# EAGLE design controller (EAGLE 6.4)
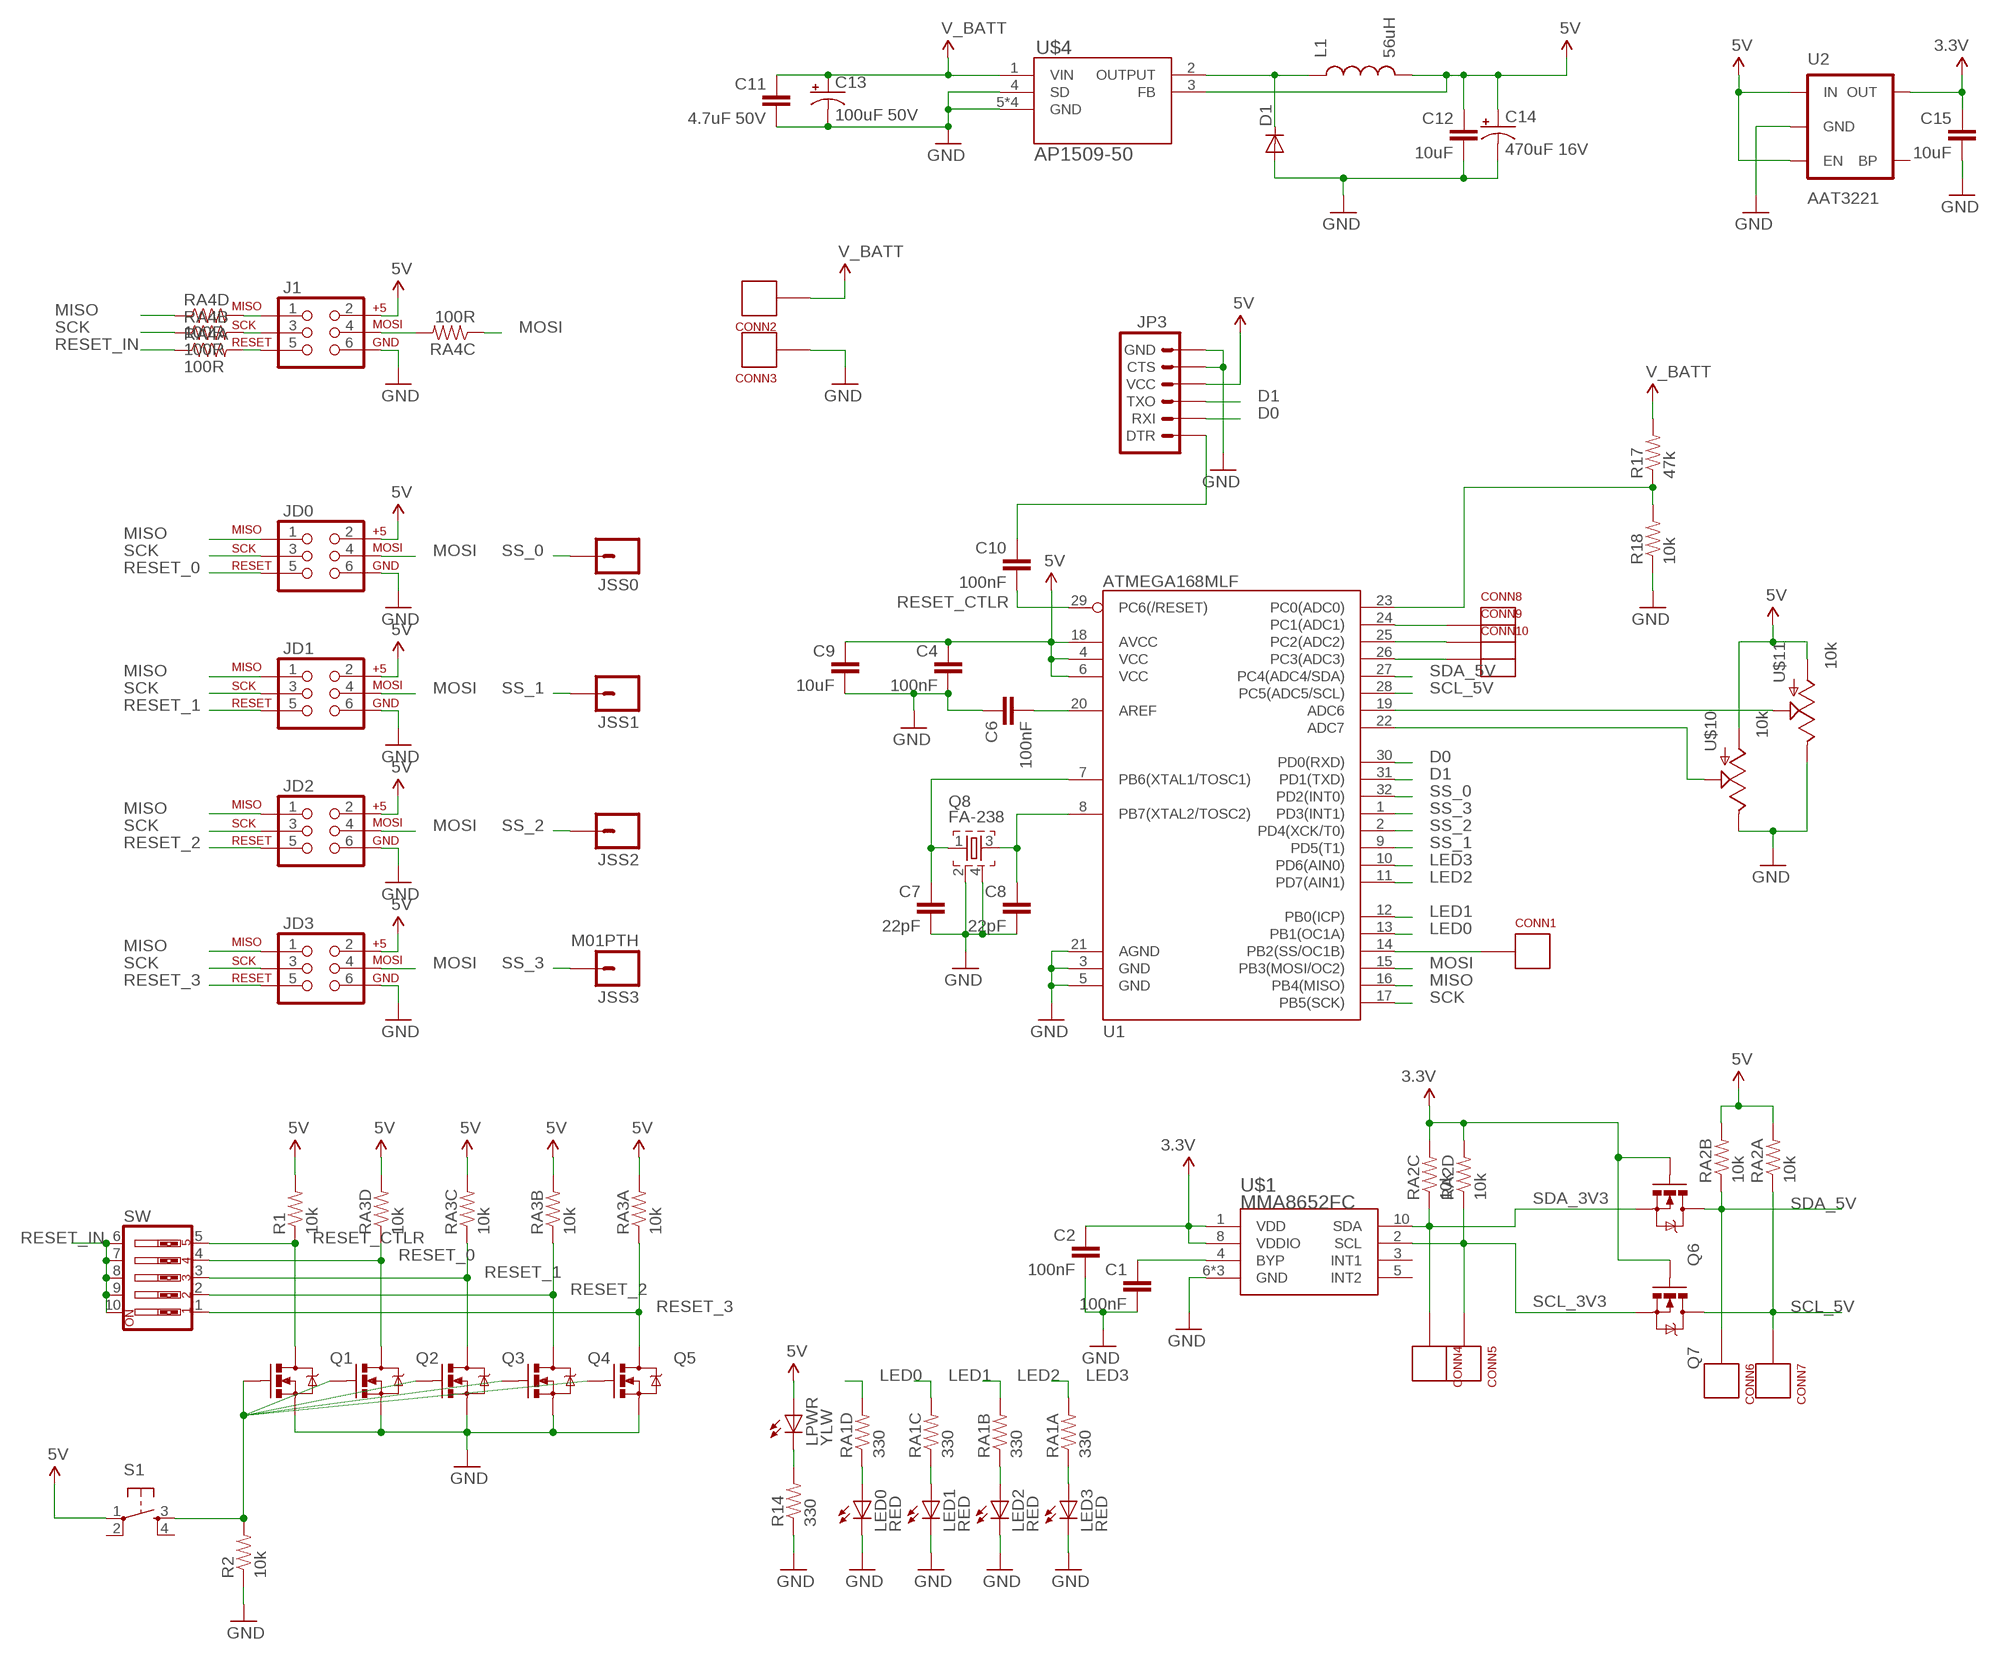
[diagram p0: schematic, sheet 1]

## Parts
C1  100nF  CAP0402-CAP  [0402-CAP]
C2  100nF  CAP0402-CAP  [0402-CAP]
C4  100nF  CAP0402-CAP  [0402-CAP]
C6  100nF  CAP0402-CAP  [0402-CAP]
C7  22pF  CAP0402-CAP  [0402-CAP]
C8  22pF  CAP0402-CAP  [0402-CAP]
C9  10uF  CAP0805  [0805]
C10  100nF  CAP0402-CAP  [0402-CAP]
C11  4.7uF 50V  CAP0805  [0805]
C12  10uF  CAP0805  [0805]
C13  100uF 50V  CAP_POLPTH6  [CAP-8-3.5]
C14  470uF 16V  CAP_POLPTH6  [CAP-8-3.5]
C15  10uF  CAP0805  [0805]
CONN1  SS  CONNECTOR  [TESTPAD]
CONN2  CONNECTOR18AWG  [HOLE_18AWG]
CONN3  CONNECTOR18AWG  [HOLE_18AWG]
CONN4  D33  CONNECTOR  [TESTPAD]
CONN5  C33  CONNECTOR  [TESTPAD]
CONN6  D50  CONNECTOR  [TESTPAD]
CONN7  C50  CONNECTOR  [TESTPAD]
CONN8  PC1  CONNECTOR  [TESTPAD]
CONN9  PC2  CONNECTOR  [TESTPAD]
CONN10  PC3  CONNECTOR  [TESTPAD]
D1  DIODESOD123W  [SOD123W(NXP)]
J1  AVR_SPI_PRG_6PTH  [2X3]
JD0  AVR_SPI_PRG_6PTH  [2X3]
JD1  AVR_SPI_PRG_6PTH  [2X3]
JD2  AVR_SPI_PRG_6PTH  [2X3]
JD3  AVR_SPI_PRG_6PTH  [2X3]
JP3  ARDUINO_SERIAL_PROGRAMPTH  [1X06]
JSS0  M01PTH  [1X01]
JSS1  M01PTH  [1X01]
JSS2  M01PTH  [1X01]
JSS3  M01PTH  [1X01]
L1  56uH  INDUCTOR1210  [1210]
LED0  RED  LED-RED0603  [LED-0603]
LED1  RED  LED-RED0603  [LED-0603]
LED2  RED  LED-RED0603  [LED-0603]
LED3  RED  LED-RED0603  [LED-0603]
LPWR  YLW  LED-RED0603  [LED-0603]
Q1  MOSFET-NCHANNELBSS123LT1G  [SOT23]
Q2  MOSFET-NCHANNELBSS123LT1G  [SOT23]
Q3  MOSFET-NCHANNELBSS123LT1G  [SOT23]
Q4  MOSFET-NCHANNELBSS123LT1G  [SOT23]
Q5  MOSFET-NCHANNELBSS123LT1G  [SOT23]
Q6  MOSFET-NCHANNELBSS123LT1G  [SOT23]
Q7  MOSFET-NCHANNELBSS123LT1G  [SOT23]
Q8  FA-238  [FA-238]
R1  10k  RESISTOR0603  [0603-RES]
R2  10k  RESISTOR0603  [0603-RES]
R14  330  RESISTOR0603  [0603-RES]
R17  47k  RESISTOR0603  [0603-RES]
R18  10k  RESISTOR0603  [0603-RES]
RA1  330  RESISTOR_ARRAY0603_X4  [0603-ARV]
RA2  10k  RESISTOR_ARRAY0603_X4  [0603-ARV]
RA3  10k  RESISTOR_ARRAY0603_X4  [0603-ARV]
RA4  100R  RESISTOR_ARRAY0603_X4  [0603-ARV]
S1  TAC_SWITCHPTH  [TACTILE-PTH]
SW  SW_DIP-5  [DIPSWITCH-05]
U1  ATMEGA168MLF  [MLF32]
U2  AAT3221  V_REG_LDOSMD  [SOT23-5]
U$1  MMA8652FC  [DFN-10]
U$4  AP1509-50  AP1509  [SO08]
U$10  10k  POTTRIM  [TRIM_POT]
U$11  10k  POTTRIM  [TRIM_POT]

## Nets
3.3V: C2.1 C15.1 Q6.1(G) Q7.1(G) RA2.5 RA2.6 U2.5(OUT) U$1.1(VDD) U$1.8(VDDIO)
5V: C4.1 C9.1 C12.1 C14.1(+) J1.2 JD0.2 JD1.2 JD2.2 JD3.2 JP3.4(VCC) L1.2 LPWR.A R1.2 RA2.7 RA2.8 RA3.5 RA3.6 RA3.7 RA3.8 S1.1 U1.4(VCC) U1.6(VCC) U1.18(AVCC) U2.1(IN) U2.3(EN) U$4.3(FB) U$10.3(A) U$11.3(A)
D0: JP3.2(RXI) U1.30(PD0(RXD))
D1: JP3.3(TXO) U1.31(PD1(TXD))
GND: C1.2 C2.2 C4.2 C6.1 C7.2 C8.2 C9.2 C11.2 C12.2 C13.2(-) C14.2(-) C15.2 CONN3.P$1(P) D1.A J1.6 JD0.6 JD1.6 JD2.6 JD3.6 JP3.5(CTS) JP3.6(GND) LED0.C LED1.C LED2.C LED3.C Q1.2(S) Q2.2(S) Q3.2(S) Q4.2(S) Q5.2(S) Q8.2 Q8.4 R2.1 R14.1 R18.1 U1.3(GND) U1.5(GND) U1.21(AGND) U2.2(GND) U$1.6(GND) U$1.7(GND) U$1.9(GND) U$4.4(SD) U$4.5(GND) U$4.6(GND) U$4.7(GND) U$4.8(GND) U$10.2(E) U$11.2(E)
LED0: RA1.5 U1.13(PB1(OC1A))
LED1: RA1.6 U1.12(PB0(ICP))
LED2: RA1.7 U1.11(PD7(AIN1))
LED3: RA1.8 U1.10(PD6(AIN0))
MISO: JD0.1 JD1.1 JD2.1 JD3.1 RA4.4 U1.16(PB4(MISO))
MOSI: JD0.4 JD1.4 JD2.4 JD3.4 RA4.3 U1.15(PB3(MOSI/OC2))
N$1: Q1.1(G) Q2.1(G) Q3.1(G) Q4.1(G) Q5.1(G) R2.2 S1.3
N$2: C8.1 Q8.3 U1.8(PB7(XTAL2/TOSC2))
N$3: C1.1 U$1.4(BYP)
N$4: C6.2 U1.20(AREF)
N$5: C7.1 Q8.1 U1.7(PB6(XTAL1/TOSC1))
N$6: CONN1.P U1.14(PB2(SS/OC1B))
N$7: LPWR.C R14.2
N$8: J1.5 RA4.8
N$9: J1.4 RA4.6
N$10: J1.1 RA4.5
N$11: LED0.A RA1.4
N$12: R17.1 R18.2 U1.23(PC0(ADC0))
N$13: LED1.A RA1.3
N$14: C10.1 JP3.1(DTR)
N$15: J1.3 RA4.7
N$16: LED2.A RA1.2
N$17: CONN8.P U1.24(PC1(ADC1))
N$18: U1.19(ADC6) U$11.1(S)
N$19: U1.22(ADC7) U$10.1(S)
N$20: CONN9.P U1.25(PC2(ADC2))
N$21: CONN10.P U1.26(PC3(ADC3))
N$22: LED3.A RA1.1
N$24: D1.C L1.1 U$4.2(OUTPUT)
RESET_0: JD0.5 Q2.3(D) RA3.4 SW.4
RESET_1: JD1.5 Q3.3(D) RA3.3 SW.3
RESET_2: JD2.5 Q4.3(D) RA3.2 SW.2
RESET_3: JD3.5 Q5.3(D) RA3.1 SW.1
RESET_CTLR: C10.2 Q1.3(D) R1.1 SW.5 U1.29(PC6(/RESET))
RESET_IN: RA4.1 SW.6 SW.7 SW.8 SW.9 SW.10
SCK: JD0.3 JD1.3 JD2.3 JD3.3 RA4.2 U1.17(PB5(SCK))
SCL_3V3: CONN5.P Q7.2(S) RA2.4 U$1.2(SCL)
SCL_5V: CONN7.P Q7.3(D) RA2.1 U1.28(PC5(ADC5/SCL))
SDA_3V3: CONN4.P Q6.2(S) RA2.3 U$1.10(SDA)
SDA_5V: CONN6.P Q6.3(D) RA2.2 U1.27(PC4(ADC4/SDA))
SS_0: JSS0.1 U1.32(PD2(INT0))
SS_1: JSS1.1 U1.9(PD5(T1))
SS_2: JSS2.1 U1.2(PD4(XCK/T0))
SS_3: JSS3.1 U1.1(PD3(INT1))
V_BATT: C11.1 C13.1(+) CONN2.P$1(P) R17.2 U$4.1(VIN)
Unconnected: S1.2 S1.4 U2.4(BP) U$1.3(INT1) U$1.5(INT2)

## Library data of the parts
C1 C2 C4 C6-C12 C15 = kmod:CAP: Capacitor Standard 0603 ceramic capacitor, and 0.1" leaded capacitor.
C13 C14 = kmod:CAP_POL: Capacitor Polarized These are standard SMD and PTH capacitors. Normally 10uF, 47uF, and 100uF in electrolytic and tantalum varieties. Always verify the external diameter of the through hole cap, it varies with capacity, voltage, and manufacturer. The EIA devices should be standard.
CONN1-CONN10 = kmod:CONNECTOR
D1 = kmod:DIODE
J1 JD0 JD1-JD3 = SparkFun-Connectors:AVR_SPI_PRG_6: AVR ISP 6 Pin This is the reduced ISP connector for AVR programming. Common on Arduino. This footprint will take up less PCB space and can be used with a 10-pin to 6-pin adapter such as SKU: BOB-08508
JP3 = SparkFun-Connectors:ARDUINO_SERIAL_PROGRAM: FTDI connector footprints
JSS0 JSS1-JSS3 = SparkFun-Connectors:M01: Header 1 Standard 1-pin 0.1" header. Use with straight break away headers (SKU : PRT-00116), right angle break away headers (PRT-00553), swiss pins (PRT-00743), machine pins (PRT-00117), and female headers (PRT-00115).
L1 = SparkFun-Passives:INDUCTOR: Inductors Basic Inductor/Choke - 0603 and 1206. Footprints are not proven and vary greatly between part numbers. SRN6045- 33uH, 20% 1.4A
LED0 LED1-LED3 = SparkFun-LED:LED-RED: Assorted Red LEDs LilyPad 1206- DIO-09912 1206- DIO-00809 0603- DIO-00819; PROD_ID: DIO-00819
LPWR = SparkFun-LED:LED-RED: Assorted Red LEDs LilyPad 1206- DIO-09912 1206- DIO-00809 0603- DIO-00819; PROD_ID: DIO-00819; VALUE: RED
Q1-Q7 = SparkFun-DiscreteSemi:MOSFET-NCHANNEL: Common NMOSFET Parts MFG P/N Store ID Prod ID FDD8780 TRANS-09984 SI7820DN TRANS-11055 FDS6630A IC-08089 2N7002PW TRANS-11151 FQP30N06L COM-10213 TRANS-10060 BSS123LT1G TRANS-08345 BSS138 TRANS-00830 BS170 2N7000; PROD_ID: TRANS-08345
Q8 = kmod:FA-: MHz RANGE CRYSTAL UNIT Source: Epson Toyocom
R1 R2 R17 R18 = kmod:RESISTOR: Resistor Basic schematic elements and footprints for 0603, 1206, and PTH resistors.
R14 = SparkFun-Resistors:RESISTOR: Resistor Basic schematic elements and footprints for 0603, 1206, and PTH resistors.
RA1-RA4 = kmod:RESISTOR_ARRAY
S1 = SparkFun-Electromechanical:TAC_SWITCH: Momentary Switch Button commonly used for reset or general input. Spark Fun Electronics SKU : COM-00097 SMT- SWCH-08247
SW = SparkFun-DiscreteSemi:SW_DIP-5
U1 = SparkFun-DigitalIC:ATMEGA168: Atmel 32-pin 8-bit micro, 16k flash.
U2 = SparkFun-PowerIC:V_REG_LDO: Voltage Regulator LDO Standard 150mA LDO voltage regulator in SOT-23 layout. Micrel part MIC5205. BP (by-pass) pin is used to lower output noise with 470pF cap.
U$1 = kmod:MMA8652FC: Freescale MMA8652FC 3-axis accelerometer
U$4 = kmod:AP1509
U$10 U$11 = kmod:POT

## Board
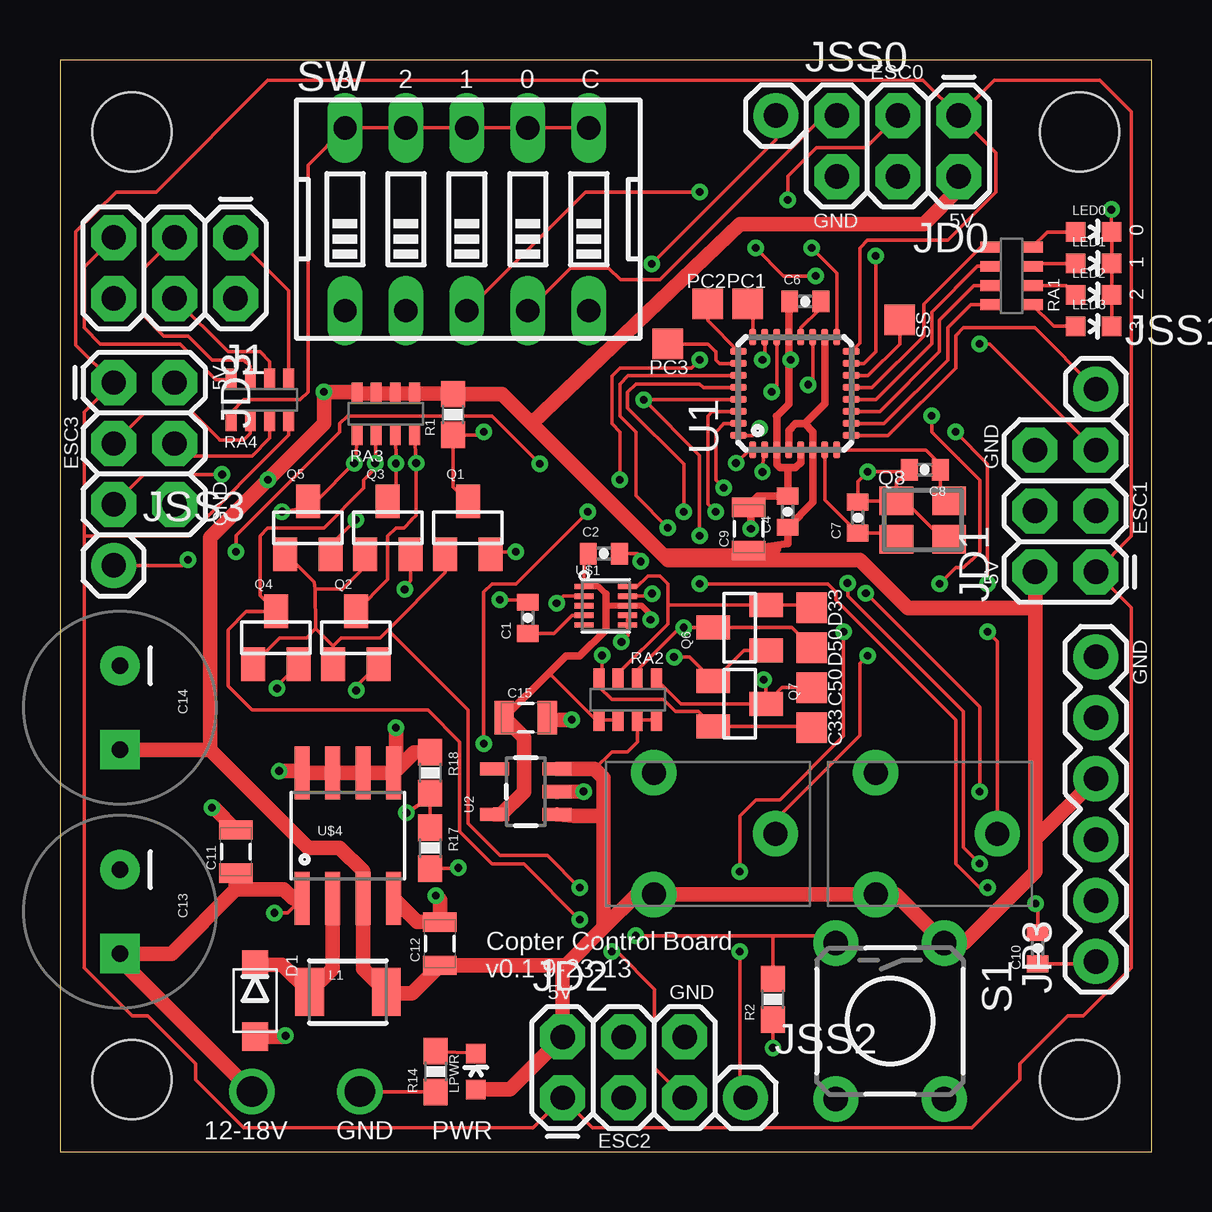
[diagram p1: board, top side]
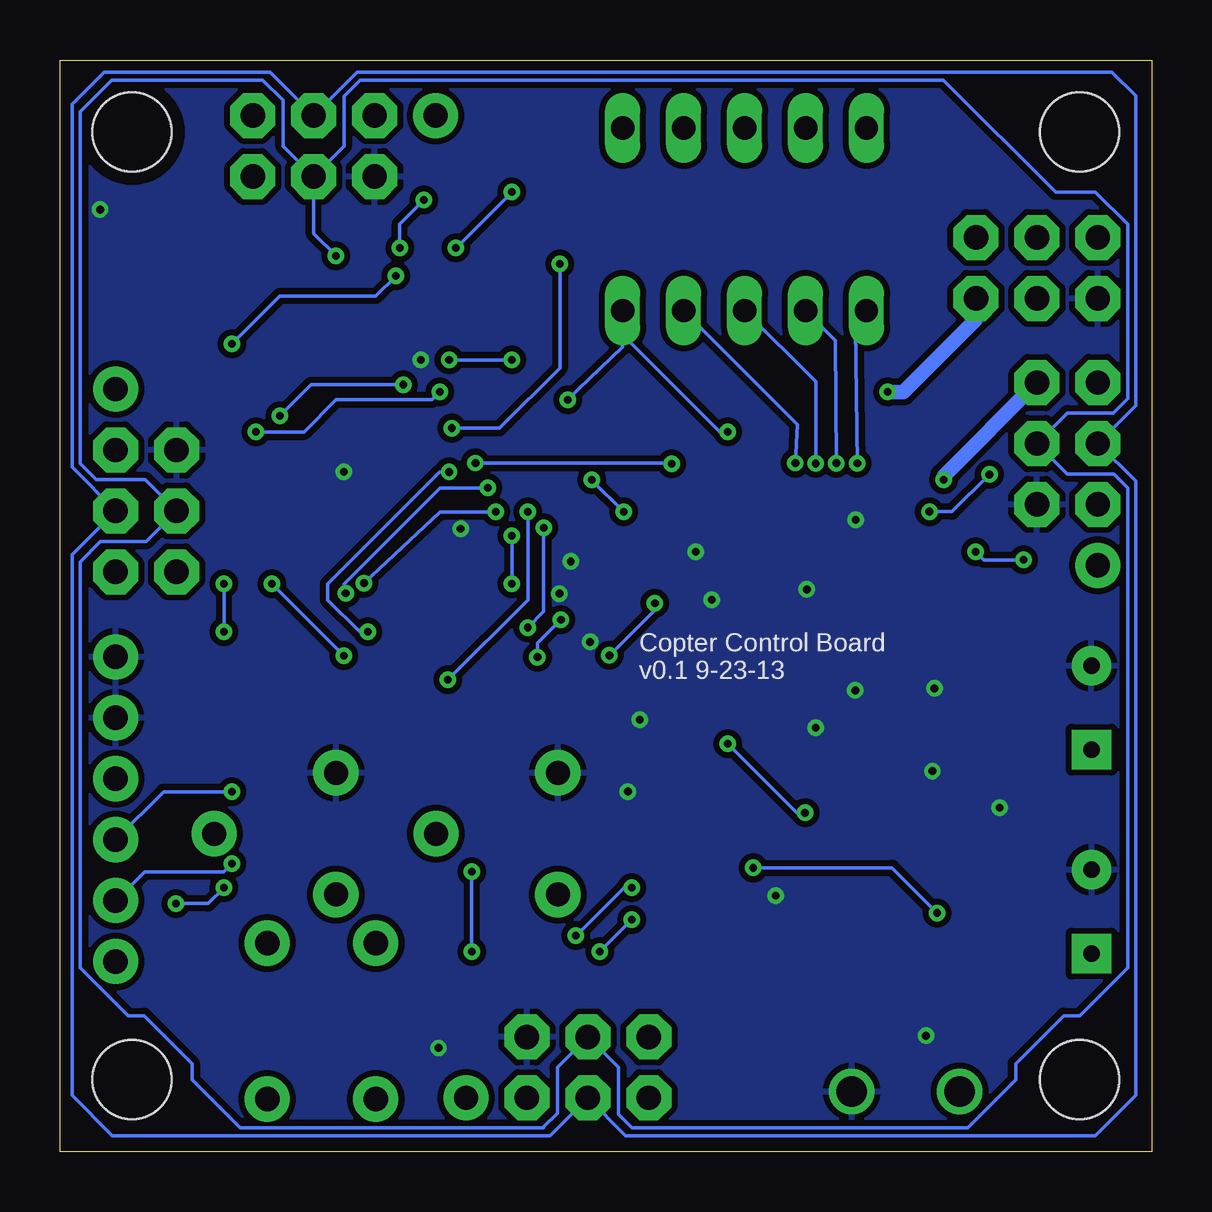
[diagram p2: board, bottom side, seen from below]

Size 45.5 x 45.5 mm. Coordinates in mm from the lower left corner, seen from the top.
Outline: 0,0 45.5,0 45.5,45.5 0,45.5 0,0
Copper layers (1*16): Top 0.0356mm / dielectric 1.5011mm / Bottom 0.0356mm
Design rules "OSHPark_mine": minimum track width 6mil, minimum drill 13mil, track to track 6mil, track to pad 6mil, pad to pad 6mil, via to via 6mil, smd to smd 6mil, copper to edge 15mil, drill to drill 6mil, minimum pad ring 7mil, minimum via ring 7mil, stop-mask expansion 2mil, vias tented up to drill 13mil, thermal gap 10mil

### Footprints (pad centres in the part's own frame; a part is rotated, then mirrored left to right if it is on the bottom)
0402-CAP = smd 0.7 x 0.9: 1 -0.65,0; 2 0.65,0
0805 = smd 0.8 x 1.4: 1 -0.9,0; 2 0.9,0
CAP-8-3.5 = drill 0.7 pad 1.651 square: 1 1.75,0 | drill 0.7 pad 1.651: 2 -1.75,0
TESTPAD = smd 1.27 x 1.27: P 0,0
HOLE_18AWG = drill 1.27: P$1 0,0
SOD123W(NXP) = smd 1.2 x 1.1: A 1.5,0; C -1.5,0
2X3 = drill 1.016 pad 1.88 octagon: 1 0,0; 2 0,2.54; 3 2.54,0; 4 2.54,2.54; 5 5.08,0; 6 5.08,2.54
1X06 = drill 1.016 pad 1.88: 1 0,0; 2 2.54,0; 3 5.08,0; 4 7.62,0; 5 10.16,0; 6 12.7,0
1X01 = drill 1.016 pad 1.88: 1 0,0
1210 = smd 1.2 x 2: 1 -1.6,0; 2 1.6,0
LED-0603 = smd 0.8 x 0.8: A 0,-0.75; C 0,0.75
SOT23 = smd 1 x 1.4: 1 -0.95,-1.1; 2 0.95,-1.1; 3 0,1.1
FA-238 = smd 1.4 x 1.2: 1 -1.1,-0.8; 2 1.1,-0.8; 3 1.1,0.8; 4 -1.1,0.8
0603-RES = smd 1.1 x 1: 1 -0.85,0; 2 0.85,0
0603-ARV = smd 0.45 x 0.9: 1 -1.2,-0.85; 2 -0.4,-0.85; 3 0.4,-0.85; 4 1.2,-0.85; 5 1.2,0.85; 6 0.4,0.85; 7 -0.4,0.85; 8 -1.2,0.85
TACTILE-PTH = drill 1.016 pad 1.88: 1 -3.251,2.261; 2 3.251,2.261; 3 -3.251,-2.261; 4 3.251,-2.261
DIPSWITCH-05 = drill 0.97 long: 1 -5.39,-3.81; 2 -2.85,-3.81; 3 -0.31,-3.81; 4 2.23,-3.81; 5 4.77,-3.81; 6 4.77,3.81; 7 2.23,3.81; 8 -0.31,3.81; 9 -2.85,3.81; 10 -5.39,3.81
MLF32 = smd 0.7 x 0.3: 1 -2.35,1.75; 2 -2.35,1.25; 3 -2.35,0.75; 4 -2.35,0.25; 5 -2.35,-0.25; 6 -2.35,-0.75; 7 -2.35,-1.25; 8 -2.35,-1.75; 17 2.35,-1.75; 18 2.35,-1.25; 19 2.35,-0.75; 20 2.35,-0.25; 21 2.35,0.25; 22 2.35,0.75; 23 2.35,1.25; 24 2.35,1.75 | smd 0.3 x 0.7: 9 -1.75,-2.35; 10 -1.25,-2.35; 11 -0.75,-2.35; 12 -0.25,-2.35; 13 0.25,-2.35; 14 0.75,-2.35; 15 1.25,-2.35; 16 1.75,-2.35; 25 1.75,2.35; 26 1.25,2.35; 27 0.75,2.35; 28 0.25,2.35; 29 -0.25,2.35; 30 -0.75,2.35; 31 -1.25,2.35; 32 -1.75,2.35
SOT23-5 = smd 0.55 x 1.2: 1 -0.95,-1.3; 2 0,-1.3; 3 0.95,-1.3; 4 0.95,1.3; 5 -0.95,1.3
DFN-10 = smd 0.8 x 0.22: 1 -0.91,0.8; 2 -0.91,0.4; 3 -0.91,0; 4 -0.91,-0.4; 5 -0.91,-0.8; 6 0.91,-0.8; 7 0.91,-0.4; 8 0.91,0; 9 0.91,0.4; 10 0.91,0.8
SO08 = smd 0.61 x 2.21: 1 -1.905,-2.616; 2 -0.635,-2.616; 3 0.635,-2.616; 4 1.905,-2.616; 5 1.905,2.616; 6 0.635,2.616; 7 -0.635,2.616; 8 -1.905,2.616
STAND-OFF = hole 3.302: 0,0
TRIM_POT = drill 1 pad 1.88: 1 5.08,0; 2 0,2.54; 3 0,-2.54

### Placement (x,y rotation side)
C1  19.5,22.25 90 top
C2  22.67,24.92 0 top
C4  30.33,26.67 90 top
C6  31.06,35.44 0 top
C7  33.25,26.43 90 top
C8  36.05,28.42 180 top
C9  28.71,25.96 90 top
C10  40.75,8.47 90 top
C11  7.33,12.5 90 top
C12  15.83,8.67 90 top
C13  2.5,10 270 top
C14  2.5,18.5 270 top
C15  19.42,18.08 0 top
CONN1  35,34.67 90 top
CONN2  8,2.5 0 top
CONN3  12.5,2.5 0 top
CONN4  31.33,22.67 90 top
CONN5  31.33,17.67 90 top
CONN6  31.33,21 90 top
CONN7  31.33,19.33 90 top
CONN8  28.67,35.33 180 top
CONN9  27,35.33 180 top
CONN10  25.33,33.67 0 top
D1  8.14,6.29 270 top
J1  7.32,38.1 180 top
JD0  37.47,43.18 180 top
JD1  43.18,24.16 90 top
JD2  20.95,2.24 0 top
JD3  2.24,32.05 270 top
JP3  43.18,7.92 90 top
JSS0  29.84,43.18 0 top
JSS1  43.18,31.78 0 top
JSS2  28.57,2.24 0 top
JSS3  2.24,24.43 0 top
L1  12,6.65 0 top
LED0  43.09,38.33 270 top
LED1  43.09,37.02 270 top
LED2  43.09,35.71 270 top
LED3  43.09,34.4 270 top
LPWR  17.33,3.33 0 top
Q1  17,26 0 top
Q2  12.33,21.41 0 top
Q3  13.67,26 0 top
Q4  9,21.41 0 top
Q5  10.33,26 0 top
Q6  28.33,21.83 90 top
Q7  28.33,18.67 270 top
Q8  35.96,26.32 0 top
R1  16.39,30.72 90 top
R2  29.72,6.35 90 top
R14  15.67,3.33 90 top
R17  15.44,12.65 270 top
R18  15.44,15.79 270 top
RA1  39.67,36.5 90 top
RA2  23.67,18.83 180 top
RA3  13.58,30.75 0 top
RA4  8.33,31.33 0 top
S1  34.6,5.44 270 top
SW  17.27,38.86 0 top
U1  30.63,31.6 90 top
U2  19.42,15 90 top
U$1  22.75,22.75 0 top
U$4  12,13.17 0 top
U$5  [STAND-OFF]  42.5,3 0 top
U$6  [STAND-OFF]  3,3 0 top
U$7  [STAND-OFF]  3,42.5 0 top
U$8  [STAND-OFF]  42.5,42.5 0 top
U$10  34,13.25 0 top
U$11  24.75,13.25 0 top

### Tracks (layer width: path | path; a pad name or v marks a point on that pad's centre or on a via)
3.3V  (via drill 0.33)
  Top 0.152: C2.1 21.85,24.76 U$1.1 | 20.38,19.95 22.47,17.87 RA2.5 RA2.6 | Q6.1 28.5,20.88 Q7.1 26.24,20.61 v25.59,20.61
  Top 0.254: 22.75,22.75 22.79,22.71 22.83,22.75 U$1.8 24.25,22.75 24.62,22.38 v24.62,22.17 | 22.75,23.25 22.45,23.55 U$1.1
  Top 0.305: C15.1 20.38,19.95 21.1,20.67 21.67,20.67 22.75,21.75 22.75,22.75 22.75,23.25
  Top 0.61: U2.5 18.38,14.05 19.33,15 19.33,17.27 C15.1
  Bottom 0.152: v25.59,20.61 25.59,21.19 v24.62,22.17
5V  (via drill 0.33)
  Top 0.152: 22.28,15.95 23,16.67 23.67,16.67 24.07,17.07 RA2.7 RA2.8
  Top 0.254: 16.37,31.6 R1.2 | 12.32,31.67 RA3.8
  Top 0.305: U1.4 30.38,30.05 30.67,30.33 31.05,30.33 | 28,25 25,25 | 28,25 29.9,25.1 C9.1 | 28,25 30.33,25.33 C4.1 31.38,27.06 U1.6 31.38,30 31.05,30.33 | U1.18 31.88,31.17 31.05,30.33
  Top 0.61: RA3.8 RA3.7 RA3.6 RA3.5 16.37,31.6 | 12.32,31.67 v11,31.67 11,30.33 v8.67,28 6.25,25.58 6.25,16.75 | L1.2 12.63,7.62 U$4.3 12.63,11.7 11.67,12.67 10.33,12.67 6.25,16.75 | 21.1,7.77 C12.1 14.67,6.6 13.72,6.6 | 21.1,7.77 22.67,9.33 | 22.67,9.33 22.67,14 | R1.2 18.43,31.57 19.67,30.33 | 22.67,9.33 24.04,10.71 U$11.3 U$10.3 34.84,10.71 S1.1 37.69,8.69 40.67,11.67 40.67,13.03 | 40.67,13.03 JP3.4 | 40.67,13.03 40.67,22.67 | 40.67,22.67 40.67,24.14 JD1.2 | 6.25,16.75 C14.1 | 21.1,7.77 20.95,7.62 JD2.2 18.76,2.58 LPWR.A | JD0.2 37.47,40.13 36,38.67 28.33,38.67 19.67,30.33 | 19.67,30.33 25,25 25.33,24.67 33.33,24.67 35.33,22.67 40.67,22.67 | U2.3 22.28,15.95 22.67,15.57 22.67,14 | U2.1 21.43,14 22.67,14
  Bottom 0.254: 8.67,28.16 v8.67,28
  Bottom 0.61: JD3.2 8.67,28.16 | J1.2 7.32,34.68 10.33,31.67 v11,31.67
D0  (via drill 0.33)
  Top 0.152: U1.30 27.18,30.85 27,30.67 27,27 v27.33,26.67 | v32.83,23.69 32.85,23.15 37.67,18.33 37.67,12.67 v38.33,12
  Bottom 0.152: v27.33,26.67 29.67,26.67 v32.83,23.69 | v38.33,12 38.67,11.67 41.98,11.67 JP3.2
D1  (via drill 0.33)
  Top 0.152: U1.31 27.68,30.35 27.67,30.33 | 27.67,30.33 | 27.67,30.33 27.33,30 27.33,28 v27.67,27.67 | v33.59,23.27 38.33,18.53 v38.33,15
  Bottom 0.152: v27.67,27.67 29.67,27.67 33.67,23.67 33.67,23.33 v33.59,23.27 | v38.33,15 41.18,15 JP3.3
GND  (via drill 0.33)
  Top 0.152: CONN3.P$1 R14.1 | LED3.C LED2.C LED1.C LED0.C 43.83,38.34 v43.83,39.26 | C1.2 19.4,23 v18.33,23 | C2.2 24.08,24.93 v24.21,24.6 | Q8.2 36.81,25.52 35.21,27.12 Q8.4 | Q8.4 33.3,27.12 C7.2 33.25,27.92 v33.67,28.33 35.33,28.33 | C8.2 34.86,27.88 Q8.4 | Q5.2 11.28,25.28 v12.33,26.33 | Q3.2 14.62,23.8 v14.37,23.43 | Q4.2 9.05,19.41 v9.05,19.3 | Q2.2 12.35,19.38 v12.35,19.22 | Q1.2 18.05,25 v19,25 | v23.41,21.25 23.67,21.51 U$1.6 U$1.7 | U$1.9 24.58,23.15 v24.69,23.26 | R2.1 v29.72,4.32
  Top 0.305: U1.5 30.88,28.73 30.67,28.51 30,28.51 29.88,28.63 U1.3 29.88,30.65 | C9.2 29.08,27.32 | 29.08,27.32 C4.2 30.33,28.33 | 29.88,30.65 29.86,30.67 | C6.1 30.38,35.07 U1.21 30.38,33.09 | 29.88,30.65 30.38,31.15 30.38,33.09 | 29.08,27.32 28.78,27.01 v28.8,25.96 | 30.38,33.09 30.33,33.04 v30.46,33
  Top 0.61: U$4.4 14.89,9.57 C12.2 15.83,10.5 v15.67,10.67 | U2.2 v21.83,15.01 | C15.2 20.4,18 v21.33,18 | U$4.5 U$4.6 U$4.7 U$4.8 10.02,15.86 v9.13,15.86 | U$4.5 14.76,16.64 R18.1 | U$4.5 14,15.88 v14,17.67 | C11.2 6.4,14.33 v6.33,14.33 | D1.A 9.36,4.79 v9.4,4.83
  pour Bottom (isolate 0.254): 0,45.5 45.5,45.5 45.5,0 0,0
LED0
  Top 0.152: RA1.5 39.12,37.67 38.33,37.67 36,35.33 36,34 33.85,31.85 U1.13
LED1
  Top 0.152: RA1.6 38.23,36.9 36.33,35 36.33,33.67 34,31.33 33,31.33 U1.12
LED2
  Top 0.152: U1.11 34.18,30.85 36.67,33.33 36.67,34.67 38.1,36.1 RA1.7
LED3
  Top 0.152: RA1.8 37.97,35.3 37,34.33 37,33 34.33,30.33 33,30.33 U1.10
MISO
  Top 0.152: 1,25.67 1,7.67 3,5.67 3.67,5.67 5.67,3.67 5.67,3 7.67,1 19.72,1 JD2.1 22.19,1 38,1 40,3 40,3.67 42,5.67 42.67,5.67 44.67,7.67 44.67,22.68 JD1.1 44.67,25.65 44.67,43.33 43.33,44.67 38.95,44.67 JD0.1 | 1,25.67 1,30.81 JD3.1 0.67,33.62 0.67,38.33 2.33,40 4,40 8.67,44.67 35.98,44.67 JD0.1 | RA4.4 9.53,29.87 5.33,25.67 1,25.67 | U1.16 33.33,33.7 33.33,37.67 33.67,38 | 33.67,38 | 33.67,38 37,38 39,40 39,41.65 JD0.1
MOSI  (via drill 0.33)
  Top 0.152: U1.15 33.52,32.85 34,33.33 v34,37.33 | JD3.4 5.29,29 8,29 8.73,29.73 RA4.3
  Bottom 0.152: JD0.4 36.2,41.91 36.2,43.81 37.05,44.67 43.33,44.67 44.67,43.33 44.67,28.67 44,28 41.94,28 JD1.4 41.91,25.43 43.81,25.43 44.67,24.58 44.67,7.67 42.67,5.67 42,5.67 40,3.67 40,3 38,1 25.33,1 25.33,1.03 24.77,1.6 24.77,3.51 JD2.4 22.23,3.51 22.23,1.56 21.67,1 7.67,1 5.67,3 5.67,3.67 3.67,5.67 3,5.67 1,7.67 1,27.67 1.57,28.24 3.51,28.24 JD3.4 3.51,30.78 1.6,30.78 1,31.39 1,38.67 2.33,40 4,40 8.67,44.67 33,44.67 33.67,44 33.67,41.9 JD0.4 | v34,37.33 34.92,38.26 JD0.4
N$1  (via drill 0.33)
  Top 0.152: Q4.1 9.15,21.41 10.28,21.41 10.67,21.8 | Q5.1 9.43,24.9 10.33,24 10.59,23.75 10.64,23.46 | 10.64,23.46 11.78,23.46 12.72,24.38 Q3.1 | 10.64,23.46 10.67,21.8 | Q2.1 11.38,21.08 | 11.38,21.08 10.67,21.8 | 11.38,21.08 11.72,21.41 13.33,21.41 13.67,21.75 | 13.67,21.75 16.05,24.13 Q1.1 | S1.3 32.03,9 29.72,9 | 29.72,9 v24,9 | v21.67,11 20.33,12.33 18.33,12.33 17,13.67 17,18.41 13.67,21.75 | R2.2 29.72,9
  Bottom 0.152: v24,9 22,11 v21.67,11
N$2
  Top 0.152: Q8.3 36.7,27.49 C8.1 36.7,28.63 36.08,29.25 U1.8
N$3
  Top 0.152: 19.71,21.81 C1.1 20.6,21.6 21.35,22.35 U$1.4
N$4
  Top 0.152: U1.20 30.88,34.33 31.65,35.1 C6.2
N$5
  Top 0.152: Q8.1 34.61,25.78 C7.1 31.88,27.15 U1.7
N$6
  Top 0.152: U1.14 33.68,32.35 35,33.67 CONN1.P
N$7
  Top 0.152: R14.2 LPWR.C
N$8
  Top 0.152: RA4.8 6.48,32.18 5,33.67 1.67,33.67 1,34.33 1,36.86 J1.5
N$9
  Top 0.152: RA4.6 8.73,32.93 8.33,33.33 7,33.33 J1.4
N$10
  Top 0.152: J1.1 9.53,35.88 RA4.5
N$11
  Top 0.152: RA1.4 41.15,38.33 LED0.A
N$12  (via drill 0.33)
  Top 0.152: R17.1 R18.2 | R18.2 | R18.2 15.73,14.94 v14.44,14.12 | v17.67,17 17.67,23.33 18,23.67 19,23.67 v22,26.67 | v23.33,28 23.33,30 23,30.33 23,32.33 23.33,32.67 26.33,32.67 v26.67,33 | v29.28,33 29.38,33.05 U1.23
  Bottom 0.152: v14.44,14.12 14.79,14.12 v17.67,17 | v22,26.67 v23.33,28 | v26.67,33 v29.28,33
N$13
  Top 0.152: RA1.3 40.97,37.02 LED1.A
N$14
  Top 0.152: C10.1 43.08,7.82 JP3.1
N$15
  Top 0.152: RA4.7 7.93,32.73 7.67,33 6.33,33 5.33,34 4.33,34 3.52,34.81 3.52,36.85 J1.3
N$16
  Top 0.152: RA1.2 41.95,36.1 LED2.A
N$17
  Top 0.152: CONN8.P 28.88,35.12 U1.24
N$18  (via drill 0.33)
  Top 0.152: U$11.1 29.83,13.83 33.33,17.33 33.33,20.33 v33.67,20.67 | v36.67,23.67 37.33,24.33 37.67,24.33 38,24.67 | 38,24.67 | 38,24.67 38.33,25 38.33,28 36.33,30 v36.33,30.67 | v31.19,31.96 31.38,32.03 U1.19
  Bottom 0.152: v33.67,20.67 v36.67,23.67 | v31.19,31.96 35.04,31.96 v36.33,30.67
N$19  (via drill 0.33)
  Top 0.152: v38.67,21.67 39.08,21.25 U$10.1 | v38.67,23.67 38.67,28.67 v37.33,30 | v29.67,31.67 29.88,31.88 U1.22
  Bottom 0.152: v38.67,21.67 v38.67,23.67 | v37.33,30 35.33,30 34,31.33 30,31.33 v29.67,31.67
N$20
  Top 0.152: U1.25 27,34.63 CONN9.P
N$21
  Top 0.152: U1.26 27.48,32.85 27.33,33 27.33,33.33 | 27.33,33.33 | 27.33,33.33 27,33.67 CONN10.P
N$22
  Top 0.152: RA1.1 41.42,34.4 LED3.A
N$24
  Top 0.61: U$4.2 11.37,7.62 L1.1 9.26,7.79 D1.C 8.26,7.67
RESET_0  (via drill 0.33)
  Top 0.152: RA3.4 v14.85,28.7 14.85,26.52 14.67,26.33 | JD0.5 31.85,43.18 25,36.33 23.36,36.33 22.86,36.83 21.28,36.83 SW.4 | 14.67,26.33 | 14.67,26.33 14.33,26 14,26 13.67,25.67 13.67,23.85 Q2.3
  Bottom 0.152: SW.4 14.76,30.31 v14.85,28.7
RESET_1  (via drill 0.33)
  Top 0.152: RA3.3 v14,28.68 14,27.43 Q3.3 | SW.3 21.91,40 v26.67,40 | v29,37.67 30.17,36.5 v31.5,36.5 | v38.33,33.67 38.76,33.67 JD1.5
  Bottom 0.152: SW.3 14,32.09 v14,28.68 | v26.67,40 v29,37.67 | v38.33,33.67 36.33,35.67 32.33,35.67 v31.5,36.5
RESET_2  (via drill 0.33)
  Top 0.152: RA3.2 v13.14,28.69 13.14,28.48 12.67,28 12.67,27.67 11,26 10.67,26 | 10.67,26 | JD2.5 24.79,3.48 24.79,6.76 23.22,8.33 v23,8.33 | v21.67,9.67 19.33,12 18,12 16.67,13.33 16.67,17.08 15.33,18.41 8,18.41 7,19.41 7,21.75 7.77,22.51 Q4.3 8.33,23.18 8.33,25.67 8.67,26 | 10.67,26 8.67,26 | 8.67,26 | 8.67,26
  Bottom 0.152: SW.2 13.17,33.8 v13.14,28.69 | v23,8.33 v21.67,9.67 | v21.67,9.67
RESET_3  (via drill 0.33)
  Top 0.152: RA3.1 12.32,28.74 v12.27,28.69 10.68,27.1 Q5.3 10.04,26.81 v9.26,26.67 | JD3.5 3.49,28.23 v6.76,28.23
  Bottom 0.152: SW.1 12.33,34.35 v12.27,28.69 | v6.76,28.23 8.31,26.67 v9.26,26.67
RESET_CTLR  (via drill 0.33)
  Top 0.152: U1.29 24.32,31.35 v24.33,31.33 26.67,29 v26.67,25.67 | Q1.3 16.39,27.71 R1.1 17.54,29.87 v17.67,30 | v26.67,23.67 32,23.67 32.33,23.33 | 32.33,23.33 | v38.67,11 38.33,11 37.33,12 37.33,18 32.33,23 32.33,23.33 | v40.67,10.33 40.75,10.25 C10.2
  Bottom 0.152: v24.33,31.33 22.05,33.52 SW.5 22.04,34.04 18,30 v17.67,30 | v26.67,25.67 v26.67,23.67 | v38.67,11 39.33,10.33 v40.67,10.33
RESET_IN
  Top 0.152: RA4.1 7.13,30.8 7.67,31.33 10,31.33 10.33,31.67 10.33,41.12 SW.10 SW.9 SW.8 SW.7 SW.6
SCK  (via drill 0.33)
  Top 0.152: U1.17 32.38,36.62 v31.33,37.67 | v30.33,39.67 30.33,40.65 31.53,41.84 33.59,41.84 JD0.3 | RA4.2 7.93,29.93 7.67,29.67 6.67,29.67 | 6.67,29.67 | 6.67,29.67 5.55,30.79 3.51,30.79 JD3.3
  Bottom 0.152: v31.33,37.67 31.33,38.67 v30.33,39.67 | JD2.3 21.92,0.67 2.33,0.67 0.67,2.33 0.67,27.94 JD3.3 0.67,31.08 0.67,44 1.67,45 33.1,45 JD0.3 36.74,45 43.67,45 45,43.67 45,28.52 JD1.3 45,24.88 45,2.33 43.33,0.67 25.07,0.67 JD2.3
SCL_3V3  (via drill 0.33)
  Top 0.152: CONN5.P 31.28,17.72 Q7.2 26.62,18.33 25.67,18.33 25.17,18.83 23,18.83 22.47,19.37 RA2.4 22.5,20.03 22.6,20.13 v22.6,20.68 | v20.7,22.85 21,23.15 U$1.2
  Bottom 0.152: v22.6,20.68 20.7,22.58 v20.7,22.85
SCL_5V  (via drill 0.33)
  Top 0.152: U1.28 26.82,31.85 26.67,32 24,32 23.67,31.67 23.67,31 26,28.67 v26,26.67 | RA2.1 25.88,18.67 Q7.3 | Q7.3 30.1,19.33 CONN7.P | v29.33,19.67 29.43,19.57 Q7.3
  Bottom 0.152: v26,26.67 26,23 v29.33,19.67
SDA_3V3
  Top 0.152: CONN4.P 31.22,22.78 Q6.2 25.33,22.78 | RA2.3 23.27,19.93 25.33,22 25.33,22.78 | U$1.10 24.01,23.51 24.5,24 25,24 25.33,23.67 25.33,22.78
SDA_5V  (via drill 0.33)
  Top 0.152: U1.27 23.68,32.35 23.33,32 23.33,30.67 24,30 24,27.33 v25.33,26 | RA2.2 24.07,20.07 25.83,21.83 v26,21.84 Q6.3 30.5,21.83 CONN6.P
  Bottom 0.152: v25.33,26 25.33,22.51 v26,21.84
SS_0  (via drill 0.33)
  Top 0.152: JSS0.1 29.84,42.18 v24.67,37 | U1.32 28.86,29.85 v29.17,30.15
  Bottom 0.152: v24.67,37 24.67,32.67 27.18,30.15 v29.17,30.15
SS_1
  Top 0.152: U1.9 34.52,29.85 37.33,32.67 37.33,34 37.67,34.33 40.63,34.33 JSS1.1
SS_2  (via drill 0.33)
  Top 0.152: U1.2 29.33,29.2 v29.28,28.32 | v32.67,21.67 32.67,17.33 30,14.67 29,14.67 28.33,14 v28.33,11.67 | v28.33,8.33 28.33,2.48 JSS2.1
  Bottom 0.152: v29.28,28.32 29.68,28.32 34.33,23.67 34.33,23 33,21.67 v32.67,21.67 | v28.33,11.67 v28.33,8.33
SS_3  (via drill 0.33)
  Top 0.152: JSS3.1 5.1,24.43 v5.33,24.67 | v7.33,25 7.33,25.67 11.67,30 11.67,30.33 12,30.67 18,30.67 v20,28.67 | U1.1 28.74,29.25 v28.18,28.7
  Bottom 0.152: v5.33,24.67 7,24.67 v7.33,25 | v28.18,28.7 20.03,28.7 v20,28.67
V_BATT  (via drill 0.33)
  Top 0.152: R17.2 16.58,11.8 v16.6,11.82 | v8.94,9.94 9.49,9.94 U$4.1
  Top 0.61: CONN2.P$1 2.5,8 C13.1 4.65,8.25 7.33,10.93 | 7.33,10.93 C11.1 | 7.33,10.93 9.33,10.93 9.72,10.55 U$4.1
  Bottom 0.152: v16.6,11.82 10.82,11.82 v8.94,9.94

### Text on the board
tPlace: ESC0 | 3 | 2 | 1 | 0 | C | GND | 5V | 0 | 1 | 2 | 3 | 5V | ESC3 | GND | GND | ESC1 | 5V | GND | Copter Control Board / v0.1 9-23-13 | 5V | GND | ESC2 | 12-18V | GND | PWR
bPlace: Copter Control Board / v0.1 9-23-13